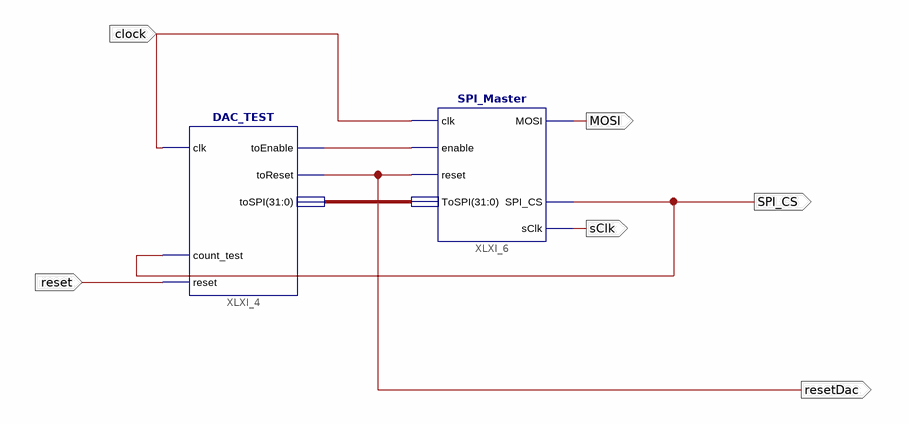
[diagram p0: schematic sheet 1]
// Xilinx ISE schematic to_dac_test.sch (spartan3e) as structural Verilog: 2 symbols, 6 ports
module to_dac_test (
  input  clock,
  input  reset,
  output MOSI,
  output sClk,
  output SPI_CS,
  output resetDac
);

  wire XLXN_3;
  wire [31:0] XLXN_1;

  DAC_TEST XLXI_4 (
    .clk(clock), .count_test(SPI_CS), .toEnable(XLXN_3), .toReset(resetDac), .toSPI(XLXN_1), .reset(reset));
  SPI_Master XLXI_6 (
    .clk(clock), .enable(XLXN_3), .reset(resetDac), .ToSPI(XLXN_1), .MOSI(MOSI), .sClk(sClk), .SPI_CS(SPI_CS));
endmodule
